# Altium schematic sheet Motor_driver.SchDoc
size A4; SheetNumber: 3; SheetTotal: 4
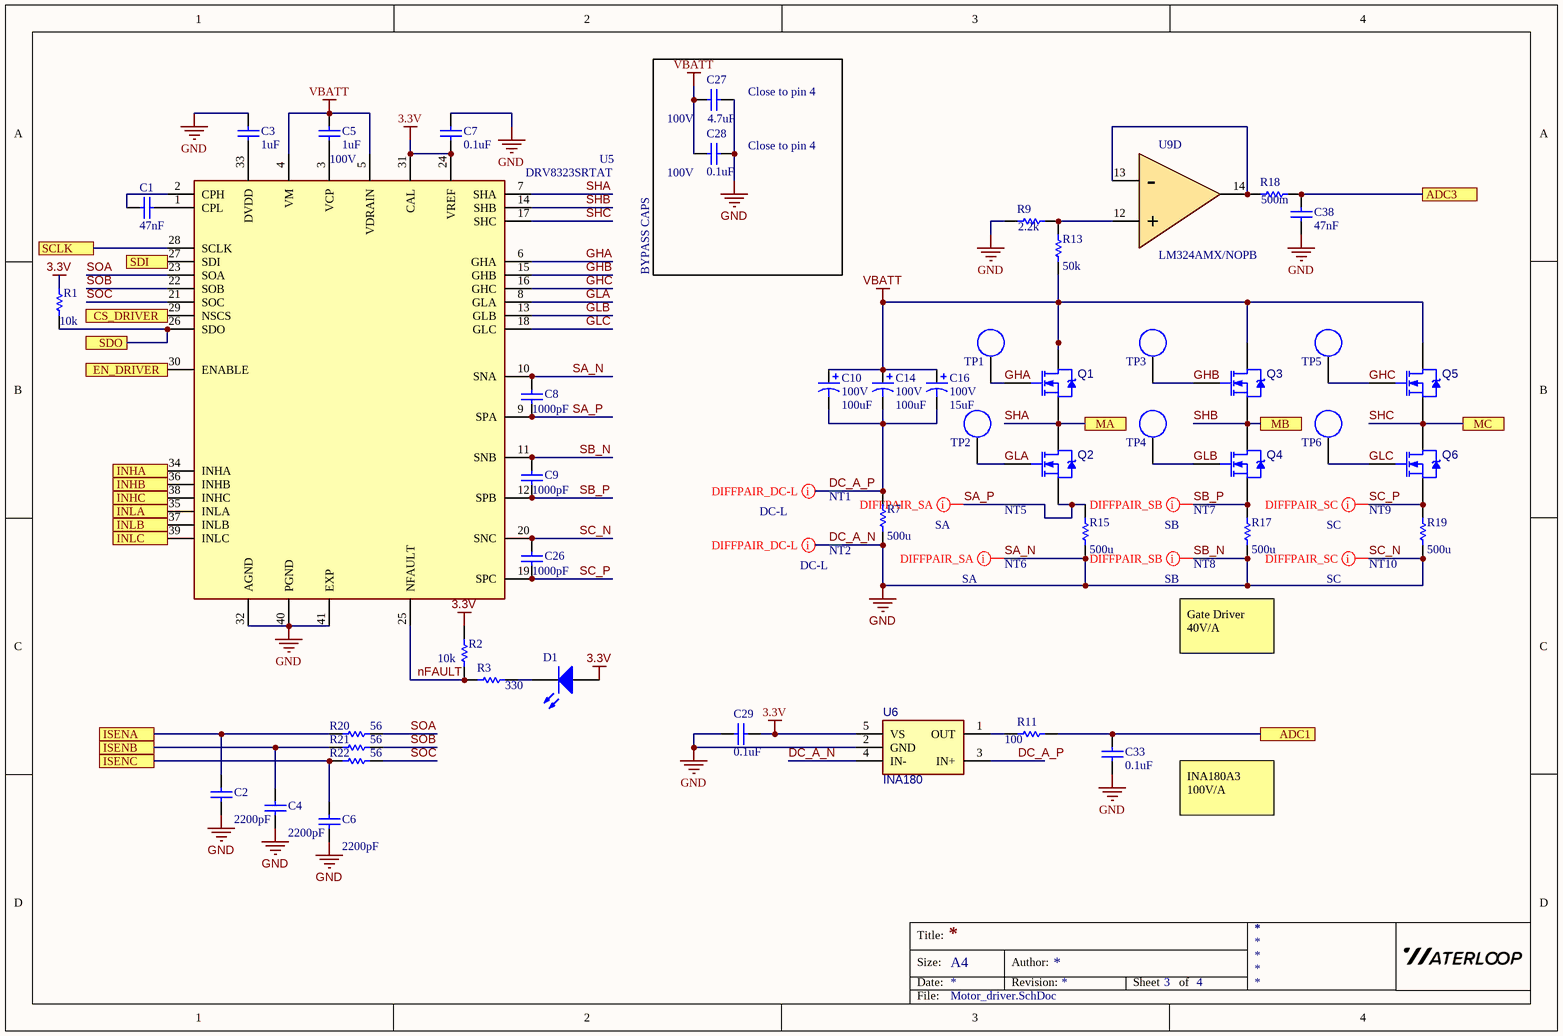
[diagram p0: Motor_driver.SchDoc]

## Parts
C1  value 47nF  [0805 - Capacitor]  (hidden comment: 100V)
C2  value 2200pF  [0805 - Capacitor]  (hidden comment: 10V)
C3  value 1uF  [0805 - Capacitor]  (hidden comment: 100V)
C4  value 2200pF  [0805 - Capacitor]  (hidden comment: 10V)
C5  100V  value 1uF  [0805 - Capacitor]
C6  value 2200pF  [0805 - Capacitor]  (hidden comment: 10V)
C7  value 0.1uF  [0805 - Capacitor]  (hidden comment: 100V)
C8  value 1000pF  [0805 - Capacitor]  (hidden comment: 10V)
C9  value 1000pF  [0805 - Capacitor]  (hidden comment: 10V)
C10  100V  value 100uF  [Electrolytic Cap]
C14  100V  value 100uF  [Electrolytic Cap]
C16  100V  value 15uF  [Electrolytic Cap]
C26  value 1000pF  [0805 - Capacitor]  (hidden comment: 10V)
C27  100V  value 4.7uF  [1210 - Capacitor]
C28  100V  value 0.1uF  [0805 - Capacitor]
C29  value 0.1uF  [0805 - Capacitor]  (hidden comment: 100V)
C33  value 0.1uF  [0805 - Capacitor]  (hidden comment: 100V)
C38  value 47nF  [0805 - Capacitor]  (hidden comment: 100V)
D1  150080SS75000  [0805_A]  (value not drawn)
NT1  NetTie  [Net Tie]  (value not drawn)  (net tie, no BOM)
NT2  NetTie  [Net Tie]  (value not drawn)  (net tie, no BOM)
NT5  NetTie  [Net Tie]  (value not drawn)  (net tie, no BOM)
NT6  NetTie  [Net Tie]  (value not drawn)  (net tie, no BOM)
NT7  NetTie  [Net Tie]  (value not drawn)  (net tie, no BOM)
NT8  NetTie  [Net Tie]  (value not drawn)  (net tie, no BOM)
NT9  NetTie  [Net Tie]  (value not drawn)  (net tie, no BOM)
NT10  NetTie  [Net Tie]  (value not drawn)  (net tie, no BOM)
Q1  NMOS-2  [TO254P1651X1067X470-3]  (value not drawn)
Q2  NMOS-2  [TO254P1651X1067X470-3]  (value not drawn)
Q3  NMOS-2  [TO254P1651X1067X470-3]  (value not drawn)
Q4  NMOS-2  [TO254P1651X1067X470-3]  (value not drawn)
Q5  NMOS-2  [TO254P1651X1067X470-3]  (value not drawn)
Q6  NMOS-2  [TO254P1651X1067X470-3]  (value not drawn)
R1  10k  [0603 - Resistor]
R2  10k  [0603 - Resistor]
R3  330  [0603 - Resistor]
R7  500u  [RESC6430X66N]
R9  2.2k  [0603 - Resistor]
R11  100  [0603 - Resistor]
R13  50k  [0603 - Resistor]
R15  500u  [RESC6430X66N]
R17  500u  [RESC6430X66N]
R18  500m  [0603 - Resistor]
R19  500u  [RESC6430X66N]
R20  56  [0603 - Resistor]
R21  56  [0603 - Resistor]
R22  56  [0603 - Resistor]
TP1  Test Point  [Test Point]  (value not drawn)  (no BOM)
TP2  Test Point  [Test Point]  (value not drawn)  (no BOM)
TP3  Test Point  [Test Point]  (value not drawn)  (no BOM)
TP4  Test Point  [Test Point]  (value not drawn)  (no BOM)
TP5  Test Point  [Test Point]  (value not drawn)  (no BOM)
TP6  Test Point  [Test Point]  (value not drawn)  (no BOM)
U5  DRV8323SRTAT  [DRV8323SRTAT]
U6  INA180  [INA180]
U9  LM324AMX/NOPB  [LM324AMX/NOPB]  (part D of 5)

## Ports
ADC1, ADC3, CS_DRIVER, EN_DRIVER, INHA, INHB, INHC, INLA, INLB, INLC, ISENA, ISENB, ISENC, MA, MB, MC, SCLK, SDI, SDO

## Nets
3.3V: C7.1 C29.1 D1.2(A) R1.1 R2.1 U5.24(VREF) U5.31(CAL) U6.5(VS)
GND: C2.2 C3.2 C4.2 C6.2 C7.2 C27.1 C28.1 C29.2 C33.2 C38.1 NT2.2 NT6.2 NT8.2 NT10.2 R7.1 R9.1 R15.1 R17.1 R19.1 U5.32(AGND) U5.40(PGND) U5.41(EXP) U6.2(GND)
VBATT: C5.2 C10.1 C14.1 C16.1 C27.2 C28.2 Q1.2(D) Q3.2(D) Q5.2(D) R13.2 U5.4(VM) U5.5(VDRAIN)
ADC1: C33.1 R11.2 ; port ADC1
ADC3: C38.2 R18.2 ; port ADC3
CS_DRIVER: U5.29(NSCS) ; port CS_DRIVER
DC_A_N: NT2.1 U6.4(IN-)
DC_A_P: NT1.1 U6.3(IN+)
EN_DRIVER: U5.30(ENABLE) ; port EN_DRIVER
GHA: Q1.1(G) TP1.0 U5.6(GHA)
GHB: Q3.1(G) TP3.0 U5.15(GHB)
GHC: Q5.1(G) TP5.0 U5.16(GHC)
GLA: Q2.1(G) TP2.0 U5.8(GLA)
GLB: Q4.1(G) TP4.0 U5.13(GLB)
GLC: Q6.1(G) TP6.0 U5.18(GLC)
INHA: U5.34(INHA) ; port INHA
INHB: U5.36(INHB) ; port INHB
INHC: U5.38(INHC) ; port INHC
INLA: U5.35(INLA) ; port INLA
INLB: U5.37(INLB) ; port INLB
INLC: U5.39(INLC) ; port INLC
ISENA: C2.1 R20.2 ; port ISENA
ISENB: C4.1 R21.2 ; port ISENB
ISENC: C6.1 R22.2 ; port ISENC
nFAULT: R2.2 R3.2 U5.25(NFAULT)
SA_N: C8.1 NT6.1 U5.10(SNA)
SA_P: C8.2 NT5.1 U5.9(SPA)
SB_N: C9.1 NT8.1 U5.11(SNB)
SB_P: C9.2 NT7.1 U5.12(SPB)
SC_N: C26.1 NT10.1 U5.20(SNC)
SC_P: C26.2 NT9.1 U5.19(SPC)
SCLK: U5.28(SCLK) ; port SCLK
SDI: U5.27(SDI) ; port SDI
SDO: R1.2 U5.26(SDO) ; port SDO
SHA: Q1.3(S) Q2.2(D) U5.7(SHA) ; port MA
SHB: Q3.3(S) Q4.2(D) U5.14(SHB) ; port MB
SHC: Q5.3(S) Q6.2(D) U5.17(SHC) ; port MC
SOA: R20.1 U5.23(SOA)
SOB: R21.1 U5.22(SOB)
SOC: R22.1 U5.21(SOC)
NetC1_1: C1.1 U5.1(CPL)
NetC1_2: C1.2 U5.2(CPH)
NetC3_1: C3.1 U5.33(DVDD)
NetC5_1: C5.1 U5.3(VCP)
NetC10_2: C10.2 C14.2 C16.2 NT1.2 R7.2
NetD1_1: D1.1(K) R3.1
NetNT5_2: NT5.2 Q2.3(S) R15.2
NetNT7_2: NT7.2 Q4.3(S) R17.2
NetNT9_2: NT9.2 Q6.3(S) R19.2
NetR9_2: R9.2 R13.1 U9.12(+)
NetR11_1: R11.1 U6.1(OUT)
NetR18_1: R18.1 U9.13(-) U9.14

## Layout directives
differential pair; Parameter 1: SA: SA_N, SA_P
differential pair; Parameter 1: SB: SB_N, SB_P
differential pair; Parameter 1: SC: SC_N, SC_P
differential pair; Parameter 1: DC-L: DC_A_N, DC_A_P

## Notes on the sheet
- (near C27) Close to pin 4
- (near C28) Close to pin 4
- BYPASS CAPS
- Gate Driver 40V/A
- INA180A3 100V/A
- Title:
- Size:
- Date:
- A4
- Author:
- Revision:
- Sheet
- of
- File:

## Library data of the parts
C1 C7 C28 C29 C33 C38 = Capacitor - Nonpolarized: CL21B104KCFNNNE, MULTILAYER CERAMIC CAPACITORS MLCC - SMD/SMT 100NF 100V 0805 ROHS; Supplier Part Number: *; Supplier: *; Manufacturer: *; Rating: *; Manufacturer Part Number: *
C2-C6 C8 C9 C26 C27 = Capacitor - Nonpolarized: TDK C2012X7S2A105KT000N, 1UF ±10% 100V X7S 0805 MULTILAYER CERAMIC CAPACITORS MLCC - SMD/SMT ROHS; Supplier Part Number: *; Supplier: *; Manufacturer: *; Rating: *; Manufacturer Part Number: *
C10 C14 = Cap Pol3: 100ZLH100MEFC10X20, Aluminum Electrolytic Capacitors Radial, Can - 10000 Hrs @ 105°C, 100UF 20% 100V /; Published: 8-Jun-2000; LatestRevisionDate: 29-May-2009; LatestRevisionNote: IPC-7351 Footprint Added.; PackageReference: C0805; Publisher: Altium Limited; PackageDescription: Chip Capacitor
C16 = Cap Pol3: EEU-EE2V150, Aluminum Electrolytic Capacitors Radial, Can - 8000 Hrs @ 105°C, CAP ALUM 15UF 20% 350V RADIAL /; Published: 8-Jun-2000; LatestRevisionDate: 29-May-2009; LatestRevisionNote: IPC-7351 Footprint Added.; PackageReference: C0805; Publisher: Altium Limited; PackageDescription: Chip Capacitor
D1 = CMP-1426-00010-1: SMD mono-color Chip LED, WL-SMCW, Super Red; Manufacturer: Wuerth Elektronik; PackageReference: 0805_A; ComponentLink2URL: http://katalog.we-online.com/led/datasheet/150080SS75000.pdf; ComponentLink1URL: http://www.we-online.com; Color: Super Red; ComponentLink2Description: Datasheet; ComponentLink1Description: Manufacturer URL; PartNumber: 150080SS75000
NT1 NT2 NT5-NT10 = Net Tie
Q1-Q6 = NMOS-2: N-Channel Power MOSFET; Note: Pin 2 is electrically connected to pin 4.; Published: 8-Jun-2000; LatestRevisionDate: 17-Jul-2002; LatestRevisionNote: Re-released for DXP Platform.; DatasheetVersion: PD-9.814; PackageVersion: Feb-1997; PackageReference: TO-220AB; Publisher: Altium Limited; PackageDescription: TO, Thru-Hole, Vertical, Heatsink Mounted; 3 In-Line Leads; Pitch 2.54 mm; ComponentLink1Description: Manufacturer Link; ComponentLink1URL: http://www.irf.com/
R1-R3 R7 R9 R11 R13 R15 R17-R22 = Resistor: Rating: *; Manufacturer Part Number: *; Manufacturer: *; Supplier Part Number: *; Supplier: *
  R1 R2: Value: 10k
  R3: Value: 330
  R7 R15 R17 R19: Value: 500u
  R9: Value: 2.2k
  R11: Value: 100
  R13: Value: 50k
  R18: Value: 500m
  R20-R22: Value: 56
U5 = DRV8323SRTAT: Multiphase Motor Driver Power MOSFET SPI 40-WQFN _6x6_; MF: Texas Instruments; SnapEDA_Link: https://www.snapeda.com/parts/DRV8323SRTAT/Texas%20Instruments/view-part/1675025/?ref=snap; Price: None; MP: DRV8323SRTAT; Package: WQFN-40 Texas Instruments; Value: *; Availability: Unavailable
U6 = INA180: 0V to 26V Current Sense Amplifier; Manufacturer: Texas Instruments; Manufacturer Part Number: INA180A2IDBVR; Datasheet: https://www.ti.com/lit/ds/symlink/ina180.pdf; Supplier Part Number: 296-47653-1-ND; Supplier: Digikey
U9 = LM324AMX/NOPB: Gen Purp 4Ch Opamp; Manufacturer: TI; Manufacturer Part Number: LM324AMX/NOPB; Supplier Part Number: LM324AMX/NOPBCT-ND; Supplier: Digikey; ComponentLink1Description: Datasheet; ComponentLink1URL: https://www.ti.com/lit/ds/symlink/lm124-n.pdf?HQS=dis-dk-null-digikeymode-dsf-pf-null-wwe&ts=1616555832552